# EAGLE design Non-contact Diameter Sensor (EAGLE 9.2.2)
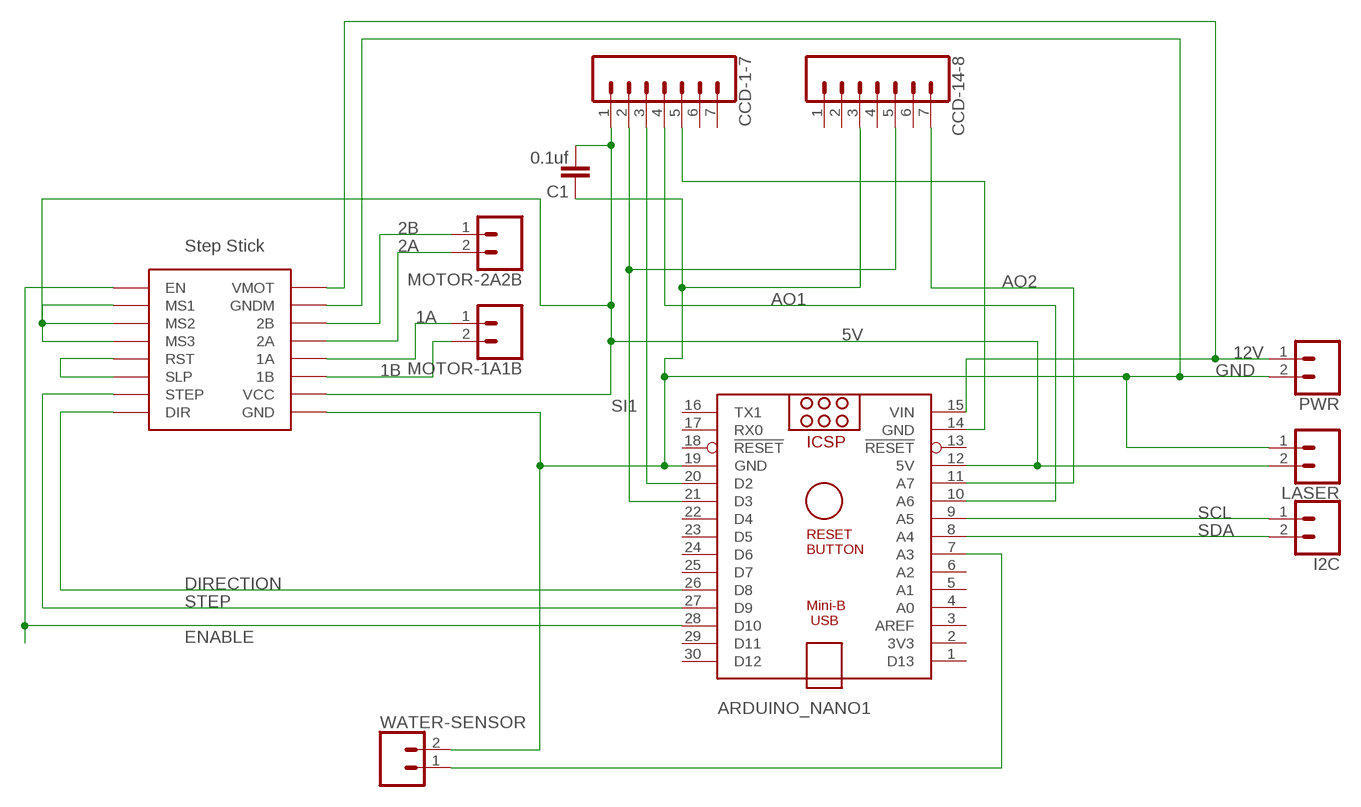
[diagram p0: schematic, sheet 1]

## Parts
ARDUINO_NANO1  ARDUINO_NANO  [ARDUINO_NANO]
C1  0.1uf  C-EU050-025X075  [C050-025X075]
CCD-1-7  CONN_07  [1X07]
CCD-14-8  CONN_07  [1X07]
I2C  CONN_023.5MM  [SCREWTERMINAL-3.5MM-2]
LASER  CONN_023.5MM  [SCREWTERMINAL-3.5MM-2]
MOTOR-1A1B  CONN_023.5MM  [SCREWTERMINAL-3.5MM-2]
MOTOR-2A2B  CONN_023.5MM  [SCREWTERMINAL-3.5MM-2]
PWR  CONN_023.5MM  [SCREWTERMINAL-3.5MM-2]
U$1  STEP-STICK  [STEP-STICK]
WATER-SENSOR  CONN_02  [1X02]

## Nets
1A: MOTOR-1A1B.1 U$1.1A
1B: MOTOR-1A1B.2 U$1.1B
2A: MOTOR-2A2B.2 U$1.2A
2B: MOTOR-2A2B.1 U$1.2B
5V: ARDUINO_NANO1.12(5V) C1.2 CCD-1-7.1 LASER.2 U$1.MS1 U$1.MS2 U$1.MS3 U$1.VCC
12V: ARDUINO_NANO1.15(VIN) PWR.1 U$1.VMOT
AO1: ARDUINO_NANO1.10(A6) CCD-1-7.4
AO2: ARDUINO_NANO1.11(A7) CCD-14-8.7
CLK: ARDUINO_NANO1.20(D2) CCD-1-7.3
DIRECTION: ARDUINO_NANO1.26(D8) U$1.DIR
ENABLE: ARDUINO_NANO1.28(D10) U$1.EN
GND: ARDUINO_NANO1.14(GND) ARDUINO_NANO1.19(GND) C1.1 CCD-1-7.5 CCD-14-8.3 LASER.1 PWR.2 U$1.GND U$1.GNDM WATER-SENSOR.2
N$1: ARDUINO_NANO1.7(A3) WATER-SENSOR.1
N$4: U$1.RST U$1.SLP
SCL: ARDUINO_NANO1.9(A5) I2C.1
SDA: ARDUINO_NANO1.8(A4) I2C.2
SI1: ARDUINO_NANO1.21(D3) CCD-1-7.2 CCD-14-8.5
STEP: ARDUINO_NANO1.27(D9) U$1.SPT(STEP)
Unconnected: ARDUINO_NANO1.1(D13) ARDUINO_NANO1.2(3V3) ARDUINO_NANO1.3(AREF) ARDUINO_NANO1.4(A0) ARDUINO_NANO1.5(A1) ARDUINO_NANO1.6(A2) ARDUINO_NANO1.13(!RESET) ARDUINO_NANO1.16(TX1) ARDUINO_NANO1.17(RX0) ARDUINO_NANO1.18(!RESET) ARDUINO_NANO1.22(D4) ARDUINO_NANO1.23(D5) ARDUINO_NANO1.24(D6) ARDUINO_NANO1.25(D7) ARDUINO_NANO1.29(D11) ARDUINO_NANO1.30(D12) CCD-1-7.6 CCD-1-7.7 CCD-14-8.1 CCD-14-8.2 CCD-14-8.4 CCD-14-8.6

## Library data of the parts
ARDUINO_NANO1 = ArduinoNanoV30:ARDUINO_NANO: Arduino Nano V3.0 Overview: The Arduino Nano is a small, complete, and breadboard-friendly board based on the ATmega328 (Arduino Nano 3.x) or ATmega168 (Arduino Nano 2.x). It has more or less the same functionality of the Arduino Duemilanove, but in a different package. It lacks only a DC power jack, and works with a Mini-B USB cable instead of a standard one. The Nano was designed and is being produced by Gravitech. Specifications: Microcontroller Atmel ATmega168 or ATmega328 Operating Voltage (logic level) 5 V Input Voltage (recommended) 7-12 V Input Voltage (limits) 6-20 V Digital I/O Pins 14 (of which 6 provide PWM output) Analog Input Pins 8 DC Current per I/O Pin 40 mA Flash Memory 16 KB (ATmega168) or 32 KB (ATmega328) of which 2 KB used by bootloader SRAM 1 KB (ATmega168) or 2 KB (ATmega328) EEPROM 512 bytes (ATmega168) or 1 KB (ATmega328) Clock Speed 16 MHz Dimensions 0.73" x 1.70" Length 45 mm Width 18 mm Weigth 5 g Power: The Arduino Nano can be powered via the Mini-B USB connection, 6-20V unregulated external power supply (pin 30), or 5V regulated external power supply (pin 27). The power source is automatically selected to the highest voltage source. Memory: The ATmega168 has 16 KB of flash memory for storing code (of which 2 KB is used for the bootloader); the ATmega328 has 32 KB, (also with 2 KB used for the bootloader). The ATmega168 has 1 KB of SRAM and 512 bytes of EEPROM (which can be read and written with the EEPROM library); the ATmega328 has 2 KB of SRAM and 1 KB of EEPROM. Input and Output: Each of the 14 digital pins on the Nano can be used as an input or output, using pinMode(), digitalWrite(), and digitalRead() functions. They operate at 5 volts. Each pin can provide or receive a maximum of 40 mA and has an internal pull-up resistor (disconnected by default) of 20-50 kOhms. In addition, some pins have specialized functions. Visit Arduino - ArduinoBoardNano <https://www.arduino.cc/en/Main/ArduinoBoardNano>
C1 = resistor - edit:C-EU: CAPACITOR, European symbol
CCD-1-7 CCD-14-8 = SparkFun-Connectors:CONN_07: Multi connection point. Often used as Generic Header-pin footprint for 0.1 inch spaced/style header connections On any of the 0.1 inch spaced packages, you can populate with these: Break Away Headers - Straight <https://www.sparkfun.com/products/116> (PRT-00116) Break Away Male Headers - Right Angle <https://www.sparkfun.com/products/553> (PRT-00553) Female Headers <https://www.sparkfun.com/products/115> (PRT-00115) Break Away Headers - Machine Pin <https://www.sparkfun.com/products/117> (PRT-00117) Break Away Female Headers - Swiss Machine Pin <https://www.sparkfun.com/products/743> (PRT-00743) For SCREWTERMINALS and SPRING TERMINALS visit here: Screw Terimnals on SparkFun.com <https://www.sparkfun.com/search/results?term=Screw+Terminals> (5mm/3.5mm/2.54mm spacing) This device is also useful as a general connection point to wire up your design to another part of your project. Our various solder wires solder well into these plated through hole pads. Hook-Up Wire - Assortment (Stranded, 22 AWG) <https://www.sparkfun.com/products/11375> (PRT-11375) Hook-Up Wire - Assortment (Solid Core, 22 AWG) <https://www.sparkfun.com/products/11367> (PRT-11367) View the entire wire category on our website here <https://www.sparkfun.com/categories/141> Special notes: Molex polarized connector foot print use with SKU : PRT-08231 with associated crimp pins and housings. 1MM SMD Version SKU: PRT-10208 NOTES ON THE VARIANTS LOCK and LOCK_LONGPADS... This footprint was designed to help hold the alignment of a through-hole component (i.e. 6-pin header) while soldering it into place. You may notice that each hole has been shifted either up or down by 0.005 of an inch from it's more standard position (which is a perfectly straight line). This slight alteration caused the pins (the squares in the middle) to touch the edges of the holes. Because they are alternating, it causes a "brace" to hold the component in place. 0.005 has proven to be the perfect amount of "off-center" position when using our standard breakaway headers. Although looks a little odd when you look at the bare footprint, once you have a header in there, the alteration is very hard to notice. Also,if you push a header all the way into place, it is covered up entirely on the bottom side.
I2C LASER MOTOR-1A1B MOTOR-2A2B PWR = SparkFun-Connectors:CONN_02: Multi connection point. Often used as Generic Header-pin footprint for 0.1 inch spaced/style header connections On any of the 0.1 inch spaced packages, you can populate with these: Break Away Headers - Straight <https://www.sparkfun.com/products/116> (PRT-00116) Break Away Male Headers - Right Angle <https://www.sparkfun.com/products/553> (PRT-00553) Female Headers <https://www.sparkfun.com/products/115> (PRT-00115) Break Away Headers - Machine Pin <https://www.sparkfun.com/products/117> (PRT-00117) Break Away Female Headers - Swiss Machine Pin <https://www.sparkfun.com/products/743> (PRT-00743) For SCREWTERMINALS and SPRING TERMINALS visit here: Screw Terimnals on SparkFun.com <https://www.sparkfun.com/search/results?term=Screw+Terminals> (5mm/3.5mm/2.54mm spacing) This device is also useful as a general connection point to wire up your design to another part of your project. Our various solder wires solder well into these plated through hole pads. Hook-Up Wire - Assortment (Stranded, 22 AWG) <https://www.sparkfun.com/products/11375> (PRT-11375) Hook-Up Wire - Assortment (Solid Core, 22 AWG) <https://www.sparkfun.com/products/11367> (PRT-11367) View the entire wire category on our website here <https://www.sparkfun.com/categories/141> Special notes: Molex polarized connector foot print use with: PRT-08233 with associated crimp pins and housings. 2.54_SCREWTERM for use with PRT-10571. 3.5mm Screw Terminal footprints for PRT-08084 5mm Screw Terminal footprints for use with PRT-08432; PROD_ID: CONN-08399
U$1 = Arduino-clone:STEP-STICK
WATER-SENSOR = SparkFun-Connectors:CONN_02: Multi connection point. Often used as Generic Header-pin footprint for 0.1 inch spaced/style header connections On any of the 0.1 inch spaced packages, you can populate with these: Break Away Headers - Straight <https://www.sparkfun.com/products/116> (PRT-00116) Break Away Male Headers - Right Angle <https://www.sparkfun.com/products/553> (PRT-00553) Female Headers <https://www.sparkfun.com/products/115> (PRT-00115) Break Away Headers - Machine Pin <https://www.sparkfun.com/products/117> (PRT-00117) Break Away Female Headers - Swiss Machine Pin <https://www.sparkfun.com/products/743> (PRT-00743) For SCREWTERMINALS and SPRING TERMINALS visit here: Screw Terimnals on SparkFun.com <https://www.sparkfun.com/search/results?term=Screw+Terminals> (5mm/3.5mm/2.54mm spacing) This device is also useful as a general connection point to wire up your design to another part of your project. Our various solder wires solder well into these plated through hole pads. Hook-Up Wire - Assortment (Stranded, 22 AWG) <https://www.sparkfun.com/products/11375> (PRT-11375) Hook-Up Wire - Assortment (Solid Core, 22 AWG) <https://www.sparkfun.com/products/11367> (PRT-11367) View the entire wire category on our website here <https://www.sparkfun.com/categories/141> Special notes: Molex polarized connector foot print use with: PRT-08233 with associated crimp pins and housings. 2.54_SCREWTERM for use with PRT-10571. 3.5mm Screw Terminal footprints for PRT-08084 5mm Screw Terminal footprints for use with PRT-08432

## Net classes
0 default: width 0.508 mm, drill 0.635 mm, clearance 0.508 mm
1 Power: width 0.762 mm, drill 0.635 mm, clearance 0.508 mm
2 GND Plane: width 0.508 mm, drill 0.635 mm, clearance 0.762 mm

## Board
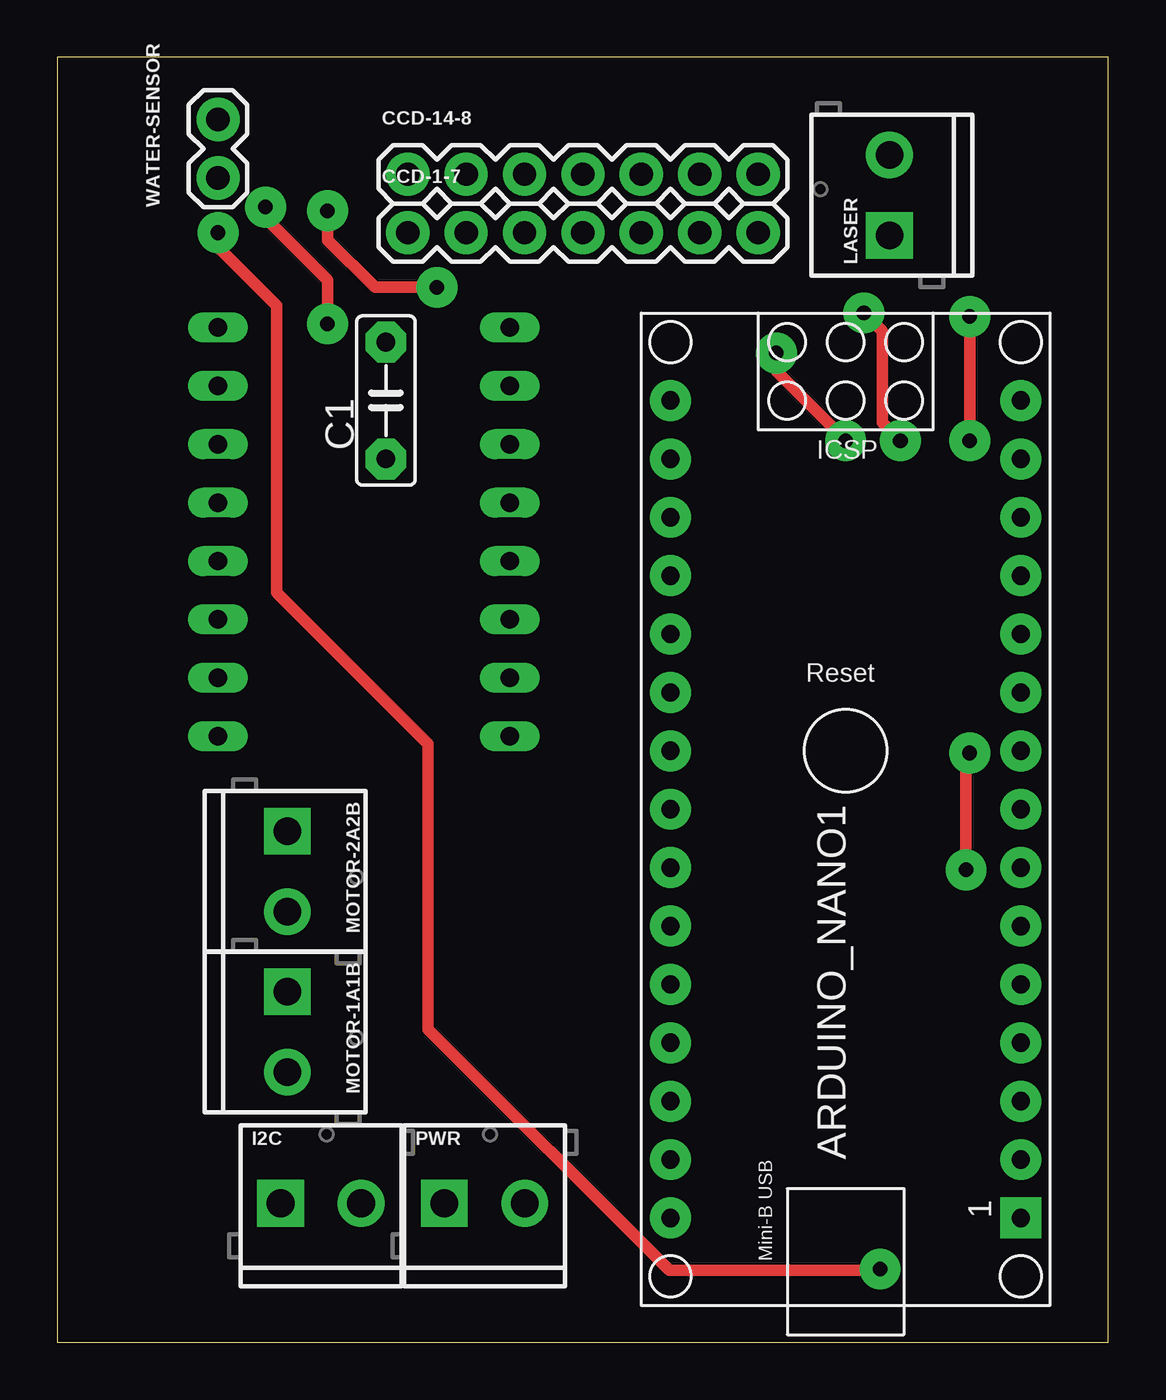
[diagram p1: board, top side]
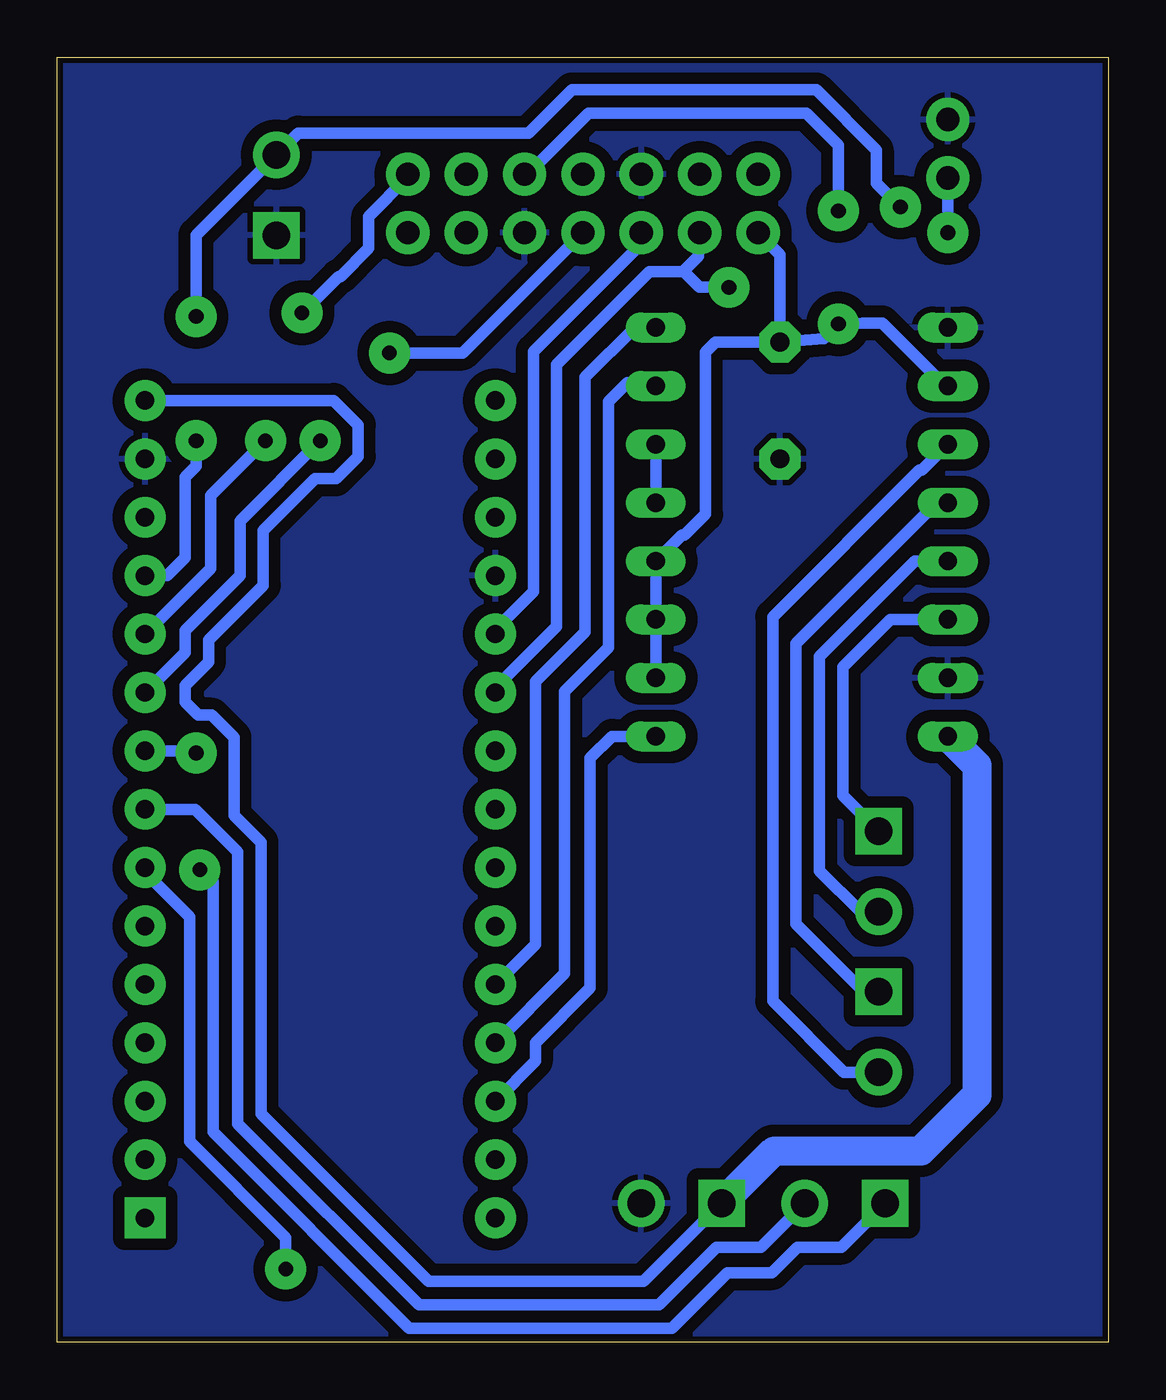
[diagram p2: board, bottom side, seen from below]

Size 45.72 x 55.88 mm. Coordinates in mm from the lower left corner, seen from the top.
Outline: 0,0 45.72,0 45.72,55.88 0,55.88 0,0
Copper layers (1*16): Top 0.035mm / dielectric 1.5mm / Bottom 0.035mm
Design rules "default *": minimum track width 6mil, minimum drill 0.35mm, track to track 6mil, track to pad 6mil, pad to pad 6mil, via to via 6mil, smd to smd 6mil, copper to edge 10mil, drill to drill 6mil, minimum pad ring 10mil, minimum via ring 8mil, stop-mask expansion 4mil, vias tented up to drill 0mil, thermal gap 10mil

### Footprints (pad centres in the part's own frame; a part is rotated, then mirrored left to right if it is on the bottom)
ARDUINO_NANO = drill 0.8 pad 1.778 square: 1 -20.32,-7.62 | drill 0.8 pad 1.778: 2 -17.78,-7.62; 3 -15.24,-7.62; 4 -12.7,-7.62; 5 -10.16,-7.62; 6 -7.62,-7.62; 7 -5.08,-7.62; 8 -2.54,-7.62; 9 0,-7.62; 10 2.54,-7.62; 11 5.08,-7.62; 12 7.62,-7.62; 13 10.16,-7.62; 14 12.7,-7.62; 15 15.24,-7.62; 16 15.24,7.62; 17 12.7,7.62; 18 10.16,7.62; 19 7.62,7.62; 20 5.08,7.62; 21 2.54,7.62; 22 0,7.62; 23 -2.54,7.62; 24 -5.08,7.62; 25 -7.62,7.62; 26 -10.16,7.62; 27 -12.7,7.62; 28 -15.24,7.62; 29 -17.78,7.62; 30 -20.32,7.62
C050-025X075 = drill 0.813 pad 1.778 octagon: 1 -2.54,0; 2 2.54,0
1X07 = drill 1.016 pad 1.88: 1 0,0; 2 2.54,0; 3 5.08,0; 4 7.62,0; 5 10.16,0; 6 12.7,0; 7 15.24,0
SCREWTERMINAL-3.5MM-2 = drill 1.2 pad 2.032 square: 1 0,0 | drill 1.2 pad 2.032: 2 3.5,0
STEP-STICK = drill 0.8 long: 1A 6.35,-1.27; 1B 6.35,-3.81; 2A 6.35,1.27; 2B 6.35,3.81; DIR -6.35,-8.89; EN -6.35,8.89; GND 6.35,-8.89; GNDM 6.35,6.35; MS1 -6.35,6.35; MS2 -6.35,3.81; MS3 -6.35,1.27; RST -6.35,-1.27; SLP -6.35,-3.81; SPT -6.35,-6.35; VCC 6.35,-6.35; VMOT 6.35,8.89
1X02 = drill 1.016 pad 1.88: 1 0,0; 2 2.54,0

### Placement (x,y rotation side)
ARDUINO_NANO1  34.29,25.72 90 top
C1  14.29,40.96 90 top
CCD-1-7  15.24,48.26 0 top
CCD-14-8  15.24,50.8 0 top
I2C  9.71,6.03 0 top
LASER  36.2,48.14 90 top
MOTOR-1A1B  10,15.24 270 top
MOTOR-2A2B  10,22.23 270 top
PWR  16.83,6.03 0 top
U$1  13.34,35.24 180 top
WATER-SENSOR  6.99,50.64 90 top

### Tracks (layer width: path | path; a pad name or v marks a point on that pad's centre or on a via)
1A
  Bottom 0.508: U$1.1A 7.46,36.51 13.59,30.39 13.59,18.19 10.64,15.24 MOTOR-1A1B.1
1B
  Bottom 0.508: U$1.1B 8.11,37.93 8.23,37.93 14.61,31.55 14.61,14.83 11.52,11.74 MOTOR-1A1B.2
2A
  Bottom 0.508: U$1.2A 8.41,33.97 12.57,29.81 12.57,20.5 10.79,18.73 MOTOR-2A2B.2
2B
  Bottom 0.508: MOTOR-2A2B.1 11.56,23.78 11.56,29.37 9.49,31.43 U$1.2B
5V  (via drill 0.64 pad 1.78)
  Top 0.508: v39.69,39.21 v39.69,44.61 | v9.05,49.37 9.05,48.9 11.75,46.2 v11.75,44.29
  Bottom 0.508: U$1.MS1 U$1.MS2 U$1.MS3 18.56,35.1 18.44,35.1 17.53,36.02 17.53,43.07 17.1,43.5 C1.2 | ARDUINO_NANO1.12 40.96,33.34 40.16,34.13 40.16,37.62 39.69,38.1 v39.69,39.21 | v39.69,44.61 39.69,48.15 LASER.2 35.24,52.59 25.22,52.59 23.34,54.47 12.71,54.47 10.1,51.86 10.1,50.42 v9.05,49.37 | U$1.VCC 7.1,41.59 9.84,44.33 10.68,44.33 v11.75,44.29 12.38,43.66 C1.2 | CCD-1-7.1 14.29,47.31 C1.2
12V
  Bottom 0.508: PWR.1 20.23,2.63 29.58,2.63 36.86,9.92 36.86,21.74 38.04,22.92 38.04,26.31 39,27.27 39.59,27.27 40.16,27.84 40.16,28.57 39.15,29.58 39.15,30.54 36.77,32.92 36.77,35.3 34.5,37.56 33.61,37.56 32.64,38.53 32.64,39.9 33.7,40.96 ARDUINO_NANO1.15
  Bottom 1.27: U$1.VMOT 5.71,25.08 5.71,10.75 8.15,8.31 14.55,8.31 PWR.1
AO1  (via drill 0.64 pad 1.78)
  Top 0.508: v31.27,43.02 31.27,42.23 v34.29,39.21
  Bottom 0.508: ARDUINO_NANO1.10 40.16,30 40.16,30.96 37.78,33.34 37.78,35.72 v34.29,39.21 | v31.27,43.02 28.1,43.02 CCD-1-7.4
AO2  (via drill 0.64 pad 1.78)
  Top 0.508: v35.08,44.77 35.88,43.97 35.88,40.01 v36.67,39.21
  Bottom 0.508: ARDUINO_NANO1.11 39.05,33.66 39.05,36.83 v36.67,39.21 | v35.08,44.77 33.5,46.35 33.41,46.35 32.18,47.58 32.18,48.97 30.48,50.67 CCD-14-8.7
CLK
  Bottom 0.508: ARDUINO_NANO1.20 26.67,31 25.02,32.65 25.02,43.09 20.32,47.78 CCD-1-7.3
DIRECTION
  Bottom 0.508: 19.54,44.28 U$1.DIR 20.6,44.13 22.77,41.97 22.77,30.89 24.92,28.73 24.92,17.3 ARDUINO_NANO1.26
ENABLE
  Bottom 0.508: ARDUINO_NANO1.28 24.92,12.22 24.92,13.02 22.54,15.4 22.54,25.4 21.59,26.35 U$1.EN
GND
  pour Bottom (isolate 0.254): 0,-0.32 0,55.88 45.72,55.88 45.72,-0.32
N$1  (via drill 0.64 pad 1.78)
  Top 0.508: v35.79,3.17 35.28,3.17 35.22,3.11 26.62,3.11 16.13,13.6 16.13,26.01 9.53,32.61 9.53,45.09 6.99,47.62 v6.99,48.26
  Bottom 0.508: ARDUINO_NANO1.7 41.91,20.43 39.97,18.5 39.97,8.72 35.79,4.54 v35.79,3.17 | v6.99,48.26 WATER-SENSOR.1
N$4
  Bottom 0.508: U$1.SLP U$1.RST
SCL  (via drill 0.64 pad 1.78)
  Top 0.508: v39.69,25.62 39.53,25.46 v39.53,20.54
  Bottom 0.508: I2C.1 11.62,4.13 13.52,4.13 14.63,3.02 16.57,3.02 18.98,0.6 30.42,0.6 38.96,9.14 38.96,20.07 v39.53,20.54 | v39.69,25.62 39.78,25.72 ARDUINO_NANO1.9
SDA
  Bottom 0.508: I2C.2 15.12,4.13 17.05,4.13 19.56,1.62 30,1.62 37.88,9.5 37.88,21.32 39.73,23.18 ARDUINO_NANO1.8
SI1  (via drill 0.64 pad 1.78)
  Top 0.508: v16.51,45.88 13.81,45.88 11.75,47.94 v11.75,49.21
  Bottom 0.508: ARDUINO_NANO1.21 26.67,28.46 24,31.13 24,42.51 19.96,46.56 18.5,46.56 | CCD-1-7.2 17.82,48.26 17.82,47.24 18.5,46.56 | v11.75,49.21 11.75,52.07 13.13,53.45 22.61,53.45 25.27,50.8 CCD-14-8.5 | v16.51,45.88 17.78,45.88 18.46,46.56 18.5,46.56
STEP
  Bottom 0.508: U$1.SPT 19.83,41.74 20.93,41.74 21.75,40.91 21.75,30.2 23.65,28.3 23.65,16.03 ARDUINO_NANO1.27